# EAGLE design mainBoard (EAGLE 9.6.2)
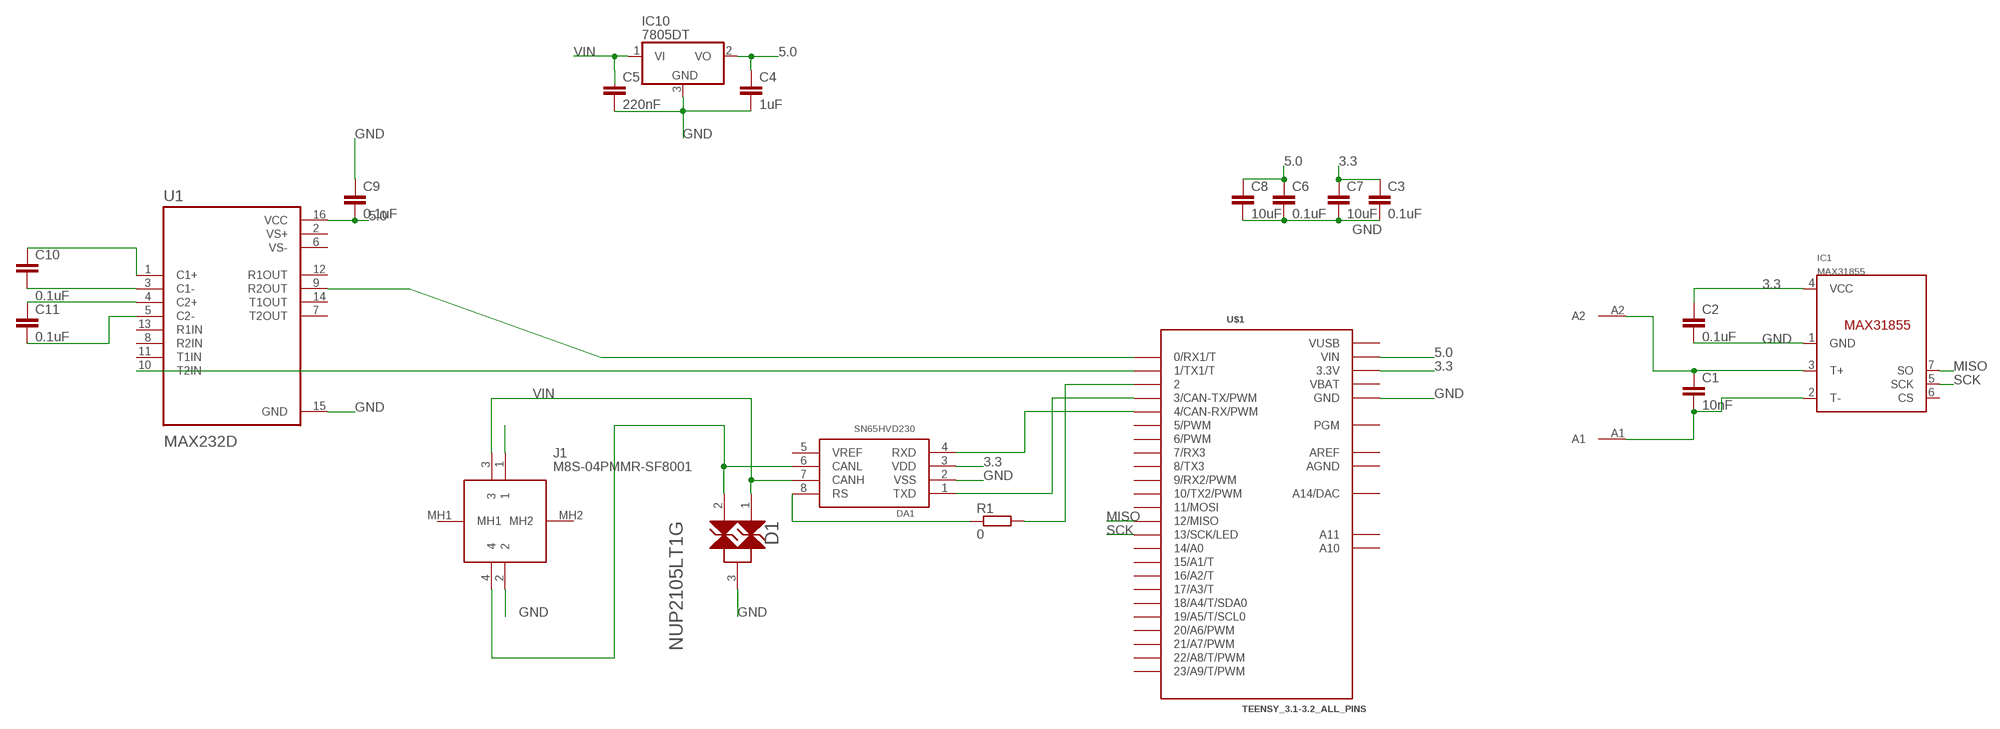
[diagram p0: schematic, sheet 1]

## Parts
C1  10nF  C-EUC0805  [C0805]
C2  0.1uF  C-EUC0805  [C0805]
C3  0.1uF  C-EUC0805  [C0805]
C4  1uF  C-EUC0805  [C0805]
C5  220nF  C-EUC0805  [C0805]
C6  0.1uF  C-EUC0805  [C0805]
C7  10uF  C-EUC0805  [C0805]
C8  10uF  C-EUC0805  [C0805]
C9  0.1uF  C-EUC0805  [C0805]
C10  0.1uF  C-EUC0805  [C0805]
C11  0.1uF  C-EUC0805  [C0805]
D1  ON_SEMICONDUCTOR_NUP2105LT1GON_SEMICONDUCTOR_NUP2105LT1G_0_0  [ON_SEMICONDUCTOR_NUP2105LT1G_0]
DA1  SN65HVD230  [SO08]
IC1  MAX31855  [SOIC8]
IC10  7805DT  [TO252]
J1  M8S-04PMMR-SF8001  [M8S04PMMRSF8001]
R1  0  R-EU_R0805  [R0805]
U1  MAX232D  [SOIC127P600X175-16N]
U$1  TEENSY_3.1-3.2_ALL_PINS  [TEENSY_3.0-3.2&LC_ALL_PINS]
U$2  PCC-SMD  [PCC-SMD]

## Nets
3.3: C2.1 C3.1 C7.1 DA1.3(VDD) IC1.4(VCC) U$1.3.3V U$1.3.3V1(3.3V)
5.0: C4.1 C6.1 C8.1 C9.2 IC10.2(VO) U1.16(VCC) U$1.VIN
GND: C2.2 C3.2 C4.2 C5.2 C6.2 C7.2 C8.2 C9.1 D1.3(3_K) DA1.2(VSS) IC1.1(GND) IC10.3(GND) J1.2 U1.15(GND) U$1.GND U$1.GND1(GND)
MISO: IC1.7(SO) U$1.12(12/MISO)
N$1: C1.1 IC1.3(T+) U$2.A2
N$2: C1.2 IC1.2(T-) U$2.A1
N$3: DA1.1(TXD) U$1.3(3/CAN-TX/PWM)
N$4: DA1.4(RXD) U$1.4(4/CAN-RX/PWM)
N$5: R1.2 U$1.2
N$6: DA1.8(RS) R1.1
N$7: C10.1 U1.1(C1+)
N$8: C10.2 U1.3(C1-)
N$9: C11.2 U1.5(C2-)
N$10: C11.1 U1.4(C2+)
N$11: U1.10(T2IN) U$1.1(1/TX1/T)
N$13: U1.9(R2OUT) U$1.0(0/RX1/T)
N$14: D1.1(1_K) DA1.7(CANH) J1.3
N$15: D1.2(2_K) DA1.6(CANL) J1.4
SCK: IC1.5(SCK) U$1.13(13/SCK/LED)
VIN: C5.1 IC10.1(VI) J1.1
Unconnected: DA1.5(VREF) IC1.6(CS) J1.MH1 J1.MH2 U1.7(T2OUT) U1.8(R2IN) U1.11(T1IN) U1.12(R1OUT) U1.13(R1IN) U1.14(T1OUT) U$1.5(5/PWM) U$1.6(6/PWM) U$1.7(7/RX3) U$1.8(8/TX3) U$1.9(9/RX2/PWM) U$1.10(10/TX2/PWM) U$1.11(11/MOSI) U$1.14/A0 U$1.15/A1(15/A1/T) U$1.16/A2(16/A2/T) U$1.17/A3(17/A3/T) U$1.18/A4(18/A4/T/SDA0) U$1.19/A5(19/A5/T/SCL0) U$1.20/A6(20/A6/PWM) U$1.21/A7(21/A7/PWM) U$1.22/A8(22/A8/T/PWM) U$1.23/A9(23/A9/T/PWM) U$1.A10 U$1.A11 U$1.PGM U$1.RESET/DAC(A14/DAC)

## Power pins joined to a net without a drawn wire
AGND: U$1.AGND
AREF: U$1.AREF
VBAT: U$1.VBAT
VS+: U1.2(VS+)
VS-: U1.6(VS-)
VUSB: U$1.VUSB

## Library data of the parts
C1-C11 = rcl:C-EU: CAPACITOR, European symbol; SPICEPREFIX: C
D1 = On Semiconductor - NUP2105LT1G:ON_SEMICONDUCTOR_NUP2105LT1G: ONSC-NUP21X5X-SOT-23-3-318-08; CIIVA_IDS: 284573; COMPONENT_LINK_1_DESCRIPTION: Manufacturer URL; COMPONENT_LINK_1_URL: http://www.onsemi.com/; COMPONENT_LINK_3_DESCRIPTION: Package Specification; COMPONENT_LINK_3_URL: http://www.onsemi.cn/pub_link/Collateral/318-08.PDF; C_MAX_PF: 30; DATASHEET: http://www.onsemi.cn/pub_link/Collateral/NUP2105L-D.PDF; DATASHEET_VERSION: Rev. 5; DIRECTION: Bidirectional; FOOTPRINT_VARIANT_NAME_0: Manufacturer Recommended; IMPORTED: yes; IMPORTED_FROM: vault; IMPORT_TS: 1521846597; IR_MAX_UA: 0.1; MF: On Semiconductor; MOUNTING_TECHNOLOGY: Surface Mount; MPN: NUP2105LT1G; NUMBER_OF_LINES: 2; PACKAGE: SOT-23-3-318-08; PACKAGE_DESCRIPTION: 3-Pin Small Outline Transistor, Body 2.92 x 1.3 mm, Pitch 0.95 mm; PACKAGE_VERSION: Rev. AP, 11/2009; PACKING: Tape and Reel; PPK_MAX_W: 350; PREFIX: D; RELEASE_DATE: 1407151382; ROHS: No; VAULT_GUID: 938C0186-F008-45DE-A757-71CE60AB9F6A; VAULT_REVISION: B5042F55-CAFE-467E-BC44-05744099C949; VBR_MIN_V: 26.2
DA1 = can_driver:SN65HVD230: CAN PHY driver 3.3-V CAN TRANSCEIVERS
IC1 = AlexW-Eagle-Libraries:MAX31855
IC10 = linear:78*: Positive VOLTAGE REGULATOR Source: http://cache.national.com/ds/LM/LM78L05.pdf http://www.fairchildsemi.com/ds/LM/LM7805.pdf
J1 = SamacSys_Parts:M8S-04PMMR-SF8001: Circular Metric Connectors M8 PANEL R/A PCB 4P M CONN M PIN Source: Datasheet; DESCRIPTION: Circular Metric Connectors M8 PANEL R/A PCB 4P M CONN M PIN; HEIGHT: 14.25mm; MANUFACTURER_NAME: Amphenol; MANUFACTURER_PART_NUMBER: M8S-04PMMR-SF8001; MOUSER_PART_NUMBER: 523-M8S04PMMRSF8001; MOUSER_PRICE-STOCK: https://www.mouser.co.uk/ProductDetail/Amphenol-LTW/M8S-04PMMR-SF8001?qs=Wmhir8UuqEknSHm9KfGzDg%3D%3D
R1 = rcl:R-EU_: RESISTOR, European symbol; SPICEPREFIX: R
U1 = MAX232D:MAX232D: Check prices <https://pricing.snapeda.com/parts/MAX232D/Texas%20Instruments/view-part?ref=eda>; AVAILABILITY: In Stock; DESCRIPTION: Dual EIA-232 driver and receiver 16-SOIC 0 to 70; MF: Texas Instruments; MP: MAX232D; PACKAGE: SOIC-16 Texas Instruments; PRICE: None; PURCHASE-URL: https://pricing.snapeda.com/search/part/MAX232D/?ref=eda
U$1 = Teensy_3_and_LC_Series_Boards_v1.4:TEENSY_3.1-3.2_ALL_PINS: Footprint for Teensy 3.1 or 3.2 board using all through-holes, i.e. the entire perimeter plus the 4 through-holes inboard (A10,A11,AREF, VUSB)
U$2 = PCC_SMD:PCC-SMD

## Board
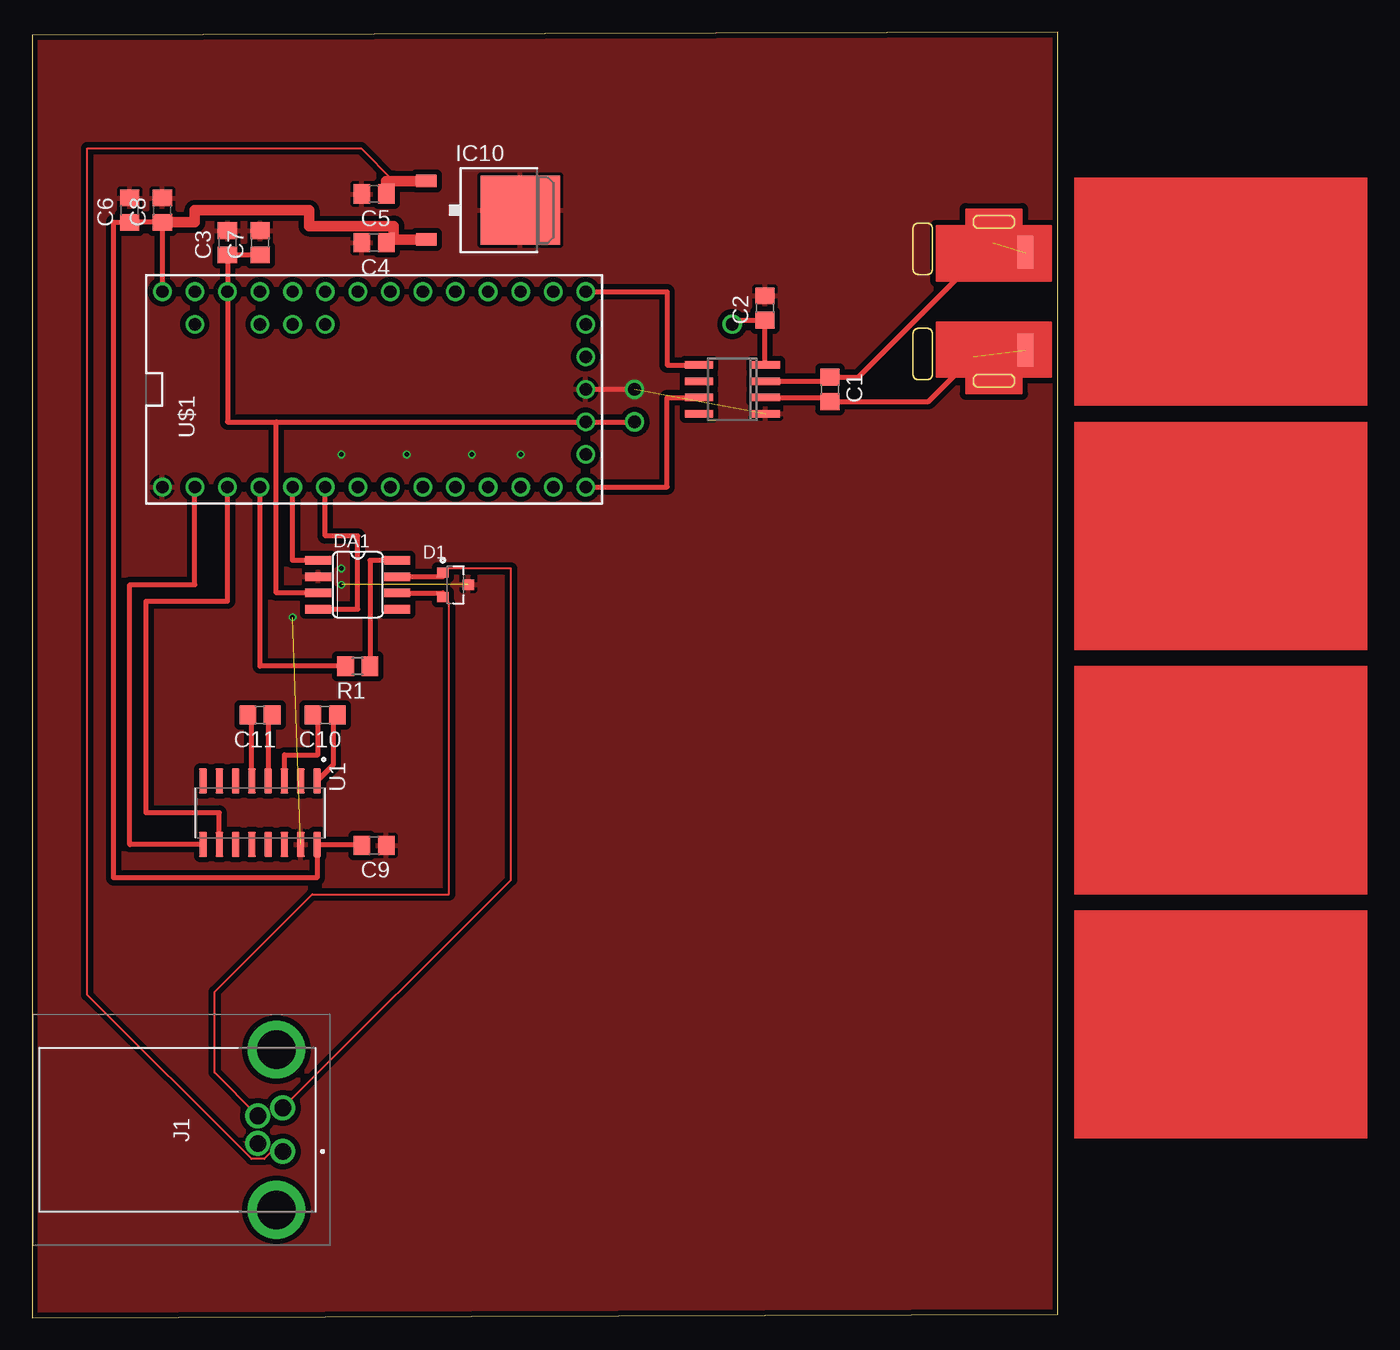
[diagram p1: board, top side]
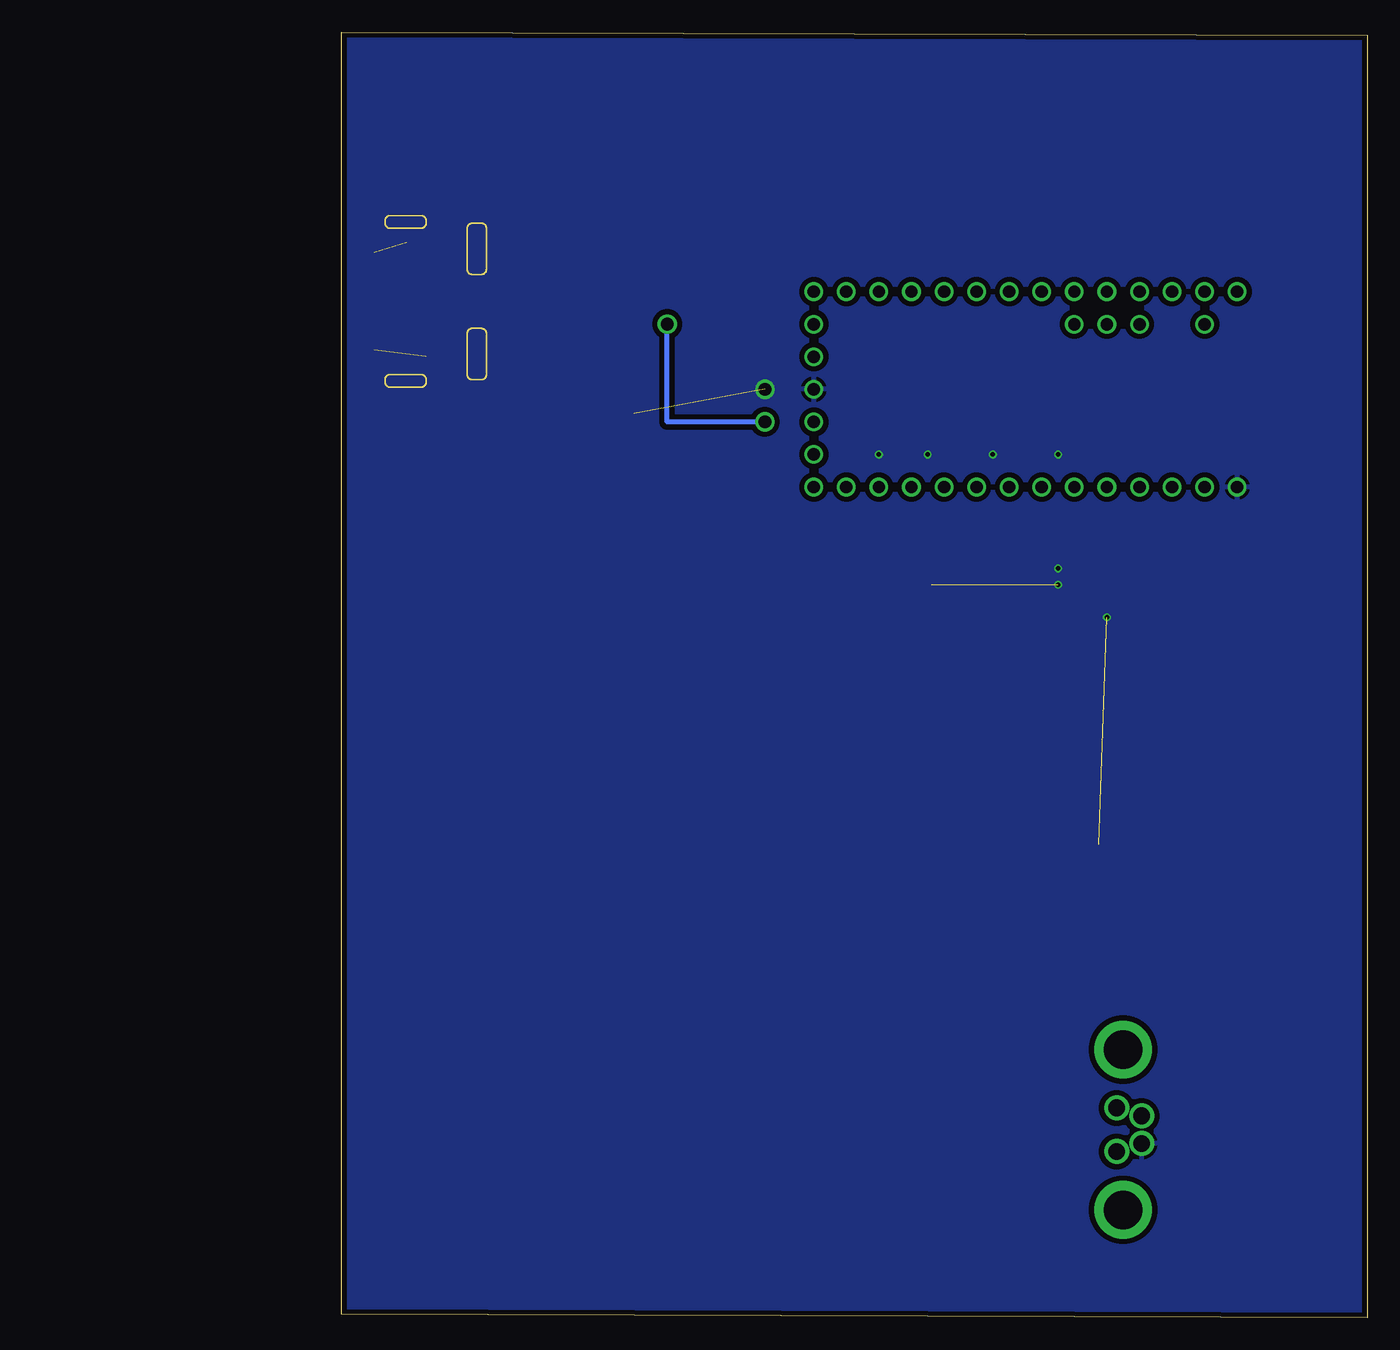
[diagram p2: board, bottom side, seen from below]

Size 79.99 x 100.25 mm. Coordinates in mm from the lower left corner, seen from the top.
Outline: 0,0 79.99,0.25 79.99,100.25 0,100 0,0
Copper layers (1*16): Top 0.035559375mm / dielectric 1.6mm / Bottom 0.035559375mm
Design rules "oshpark-2layer": minimum track width 6mil, minimum drill 10mil, track to track 6mil, track to pad 6mil, pad to pad 6mil, via to via 6mil, smd to smd 6mil, copper to edge 15mil, drill to drill 6mil, minimum pad ring 5mil, minimum via ring 5mil, stop-mask expansion 2.5mil, vias tented up to drill 0mil, thermal gap 10mil

### Footprints (pad centres in the part's own frame; a part is rotated, then mirrored left to right if it is on the bottom)
C0805 = smd 1.3 x 1.5: 1 -0.95,0; 2 0.95,0
ON_SEMICONDUCTOR_NUP2105LT1G_0 = smd 0.9 x 0.8: 1 -1,0.95; 2 -1,-0.95; 3 1,0
SO08 = smd 0.66 x 2.032: 1 -1.905,-3.073; 2 -0.635,-3.073; 3 0.635,-3.073; 4 1.905,-3.073; 5 1.905,3.073; 6 0.635,3.073; 7 -0.635,3.073; 8 -1.905,3.073
SOIC8 = smd 0.6 x 2.2: 1 -1.905,-2.6; 2 -0.635,-2.6; 3 0.635,-2.6; 4 1.905,-2.6; 5 1.905,2.6; 6 0.635,2.6; 7 -0.635,2.6; 8 -1.905,2.6
TO252 = smd 1 x 1.6: 1 -2.28,-4.8; 2 2.28,-4.8 | smd 5.4 x 6.2: 3 0,2.5
M8S04PMMRSF8001 = drill 1.3 pad 1.9: 1 0,0; 2 -0.625,-1.95; 3 -3.4,0; 4 -2.775,-1.95 | drill 3 pad 4.5: MH1 -7.95,-0.5; MH2 4.55,-0.5
R0805 = smd 1.3 x 1.5: 1 -0.95,0; 2 0.95,0
SOIC127P600X175-16N = smd 1.97 x 0.6: 1 -2.475,4.445; 2 -2.475,3.175; 3 -2.475,1.905; 4 -2.475,0.635; 5 -2.475,-0.635; 6 -2.475,-1.905; 7 -2.475,-3.175; 8 -2.475,-4.445; 9 2.475,-4.445; 10 2.475,-3.175; 11 2.475,-1.905; 12 2.475,-0.635; 13 2.475,0.635; 14 2.475,1.905; 15 2.475,3.175; 16 2.475,4.445
TEENSY_3.0-3.2&LC_ALL_PINS = drill 0.965: 0 -7.62,13.97; 1 -7.62,11.43; 2 -7.62,8.89; 3 -7.62,6.35; 3.3V 7.62,11.43; 3.3V1 -2.54,-16.51; 4 -7.62,3.81; 5 -7.62,1.27; 6 -7.62,-1.27; 7 -7.62,-3.81; 8 -7.62,-6.35; 9 -7.62,-8.89; 10 -7.62,-11.43; 11 -7.62,-13.97; 12 -7.62,-16.51; 13 7.62,-16.51; 14/A0 7.62,-13.97; 15/A1 7.62,-11.43; 16/A2 7.62,-8.89; 17/A3 7.62,-6.35; 18/A4 7.62,-3.81; 19/A5 7.62,-1.27; 20/A6 7.62,1.27; 21/A7 7.62,3.81; 22/A8 7.62,6.35; 23/A9 7.62,8.89; A10 5.08,6.35; A11 5.08,3.81; AGND 7.62,13.97; AREF 5.08,8.89; GND -7.62,16.51; GND1 0,-16.51; PGM 2.54,-16.51; RESET/DAC 5.08,-16.51; VBAT -5.08,-16.51; VIN 7.62,16.51; VUSB 5.08,13.97
PCC-SMD = smd 2.54 x 1.27: A1 -3.81,2.54; A2 3.81,2.54

### Placement (x,y rotation side)
C1  62.23,72.39 270 top
C2  57.15,78.74 90 top
C3  15.24,83.82 90 top
C4  26.67,83.82 180 top
C5  26.67,87.63 180 top
C6  7.62,86.36 90 top
C7  17.78,83.82 90 top
C8  10.16,86.36 90 top
C9  26.67,36.83 180 top
C10  22.86,46.99 180 top
C11  17.78,46.99 180 top
D1  33.02,57.15 0 top
DA1  25.4,57.15 270 top
IC1  54.61,72.39 90 top
IC10  35.56,86.36 270 top
J1  19.56,12.95 270 top
R1  25.4,50.8 180 top
U1  17.78,39.37 270 top
U$1  26.67,72.39 90 top
U$2  80.01,79.25 90 top

### Tracks (layer width: path | path; a pad name or v marks a point on that pad's centre or on a via)
3.3  (via drill 1)
  Top 0.406: C7.1 C3.1 U$1.3.3V 15.24,69.85 19.05,69.85 | 19.05,69.85 U$1.3.3V1 v46.99,69.85 | IC1.4 57.15,74.3 C2.1 54.61,77.79 v54.61,77.47 | DA1.3 19.05,56.52 19.05,69.85
  Bottom 0.406: v46.99,69.85 54.61,69.85 v54.61,77.47
5.0
  Top 0.406: U$1.VIN C8.1 C6.1 6.35,85.41 6.35,34.29 22.23,34.29 U1.16 25.72,36.9 C9.2
  Top 0.813: C4.1 27.62,84.08 IC10.2 28.2,84.08 28.2,85.13 21.59,85.13 21.59,86.36 12.7,86.36 12.7,85.41 C8.1
GND  (via drill 0.35, 1)  (3 unrouted)
  Top 0.406: U$1.GND1 v46.99,72.39
  other vias: 24.13,57.15 24.13,58.42 20.32,54.61 24.13,67.31 29.21,67.31 34.29,67.31 38.1,67.31
  pour Top (isolate 0.406): -6.35,104.14 82.55,104.14 82.55,-5.08 -6.35,-5.08
  pour Bottom (isolate 0.406): -7.62,104.14 85.09,104.14 85.09,-7.62 -7.62,-7.62
MISO
  Top 0.406: U$1.12 49.53,64.77 49.53,71.75 IC1.7
N$1  (1 unrouted)
  Top 0.406: IC1.3 62.23,73.03 C1.1 64.45,73.34 74.93,83.82
N$2  (1 unrouted)
  Top 0.406: IC1.2 62.23,71.75 C1.2 69.92,71.44 73.41,74.93
N$3
  Top 0.406: DA1.1 20.32,59.05 U$1.3
N$4
  Top 0.406: DA1.4 25.4,55.24 25.4,60.96 22.86,60.96 U$1.4
N$5
  Top 0.406: R1.2 17.78,50.8 U$1.2
N$6
  Top 0.406: DA1.8 26.35,59.05 R1.1
N$7
  Top 0.406: C10.1 23.5,46.67 23.5,43.12 U1.1
N$8
  Top 0.406: U1.3 19.68,43.89 22.28,43.89 22.28,46.62 C10.2
N$9
  Top 0.406: U1.5 17.14,46.99 C11.2
N$10
  Top 0.406: C11.1 18.41,46.67 U1.4
N$11
  Top 0.406: U1.10 14.61,39.37 8.89,39.37 8.89,55.88 15.24,55.88 U$1.1
N$13
  Top 0.406: U1.9 7.62,36.9 7.62,57.15 12.7,57.15 U$1.0
N$14
  Top 0.152: J1.3 37.34,34.13 37.34,58.42 32.34,58.42 D1.1
  Top 0.406: DA1.7 32.02,57.78 D1.1
N$15
  Top 0.152: J1.4 14.22,19.11 14.22,25.4 21.84,33.02 32.51,33.02 32.51,55.71 D1.2
  Top 0.406: DA1.6 32.02,56.52 D1.2
SCK
  Top 0.406: U$1.13 49.53,80.01 49.53,74.3 IC1.5
VIN
  Top 0.152: J1.1 18.68,12.95 18.11,12.38 17.11,12.38 4.32,25.17 4.32,91.19 25.65,91.19 28.19,88.64
  Top 0.813: C5.1 27.62,88.64 28.19,88.64 IC10.1
(copper drawn outside any net)
  shapes: Top area x4